# EasyEDA Pro project 工程技术综合实践课程设计.eprj, board 核心板PCB
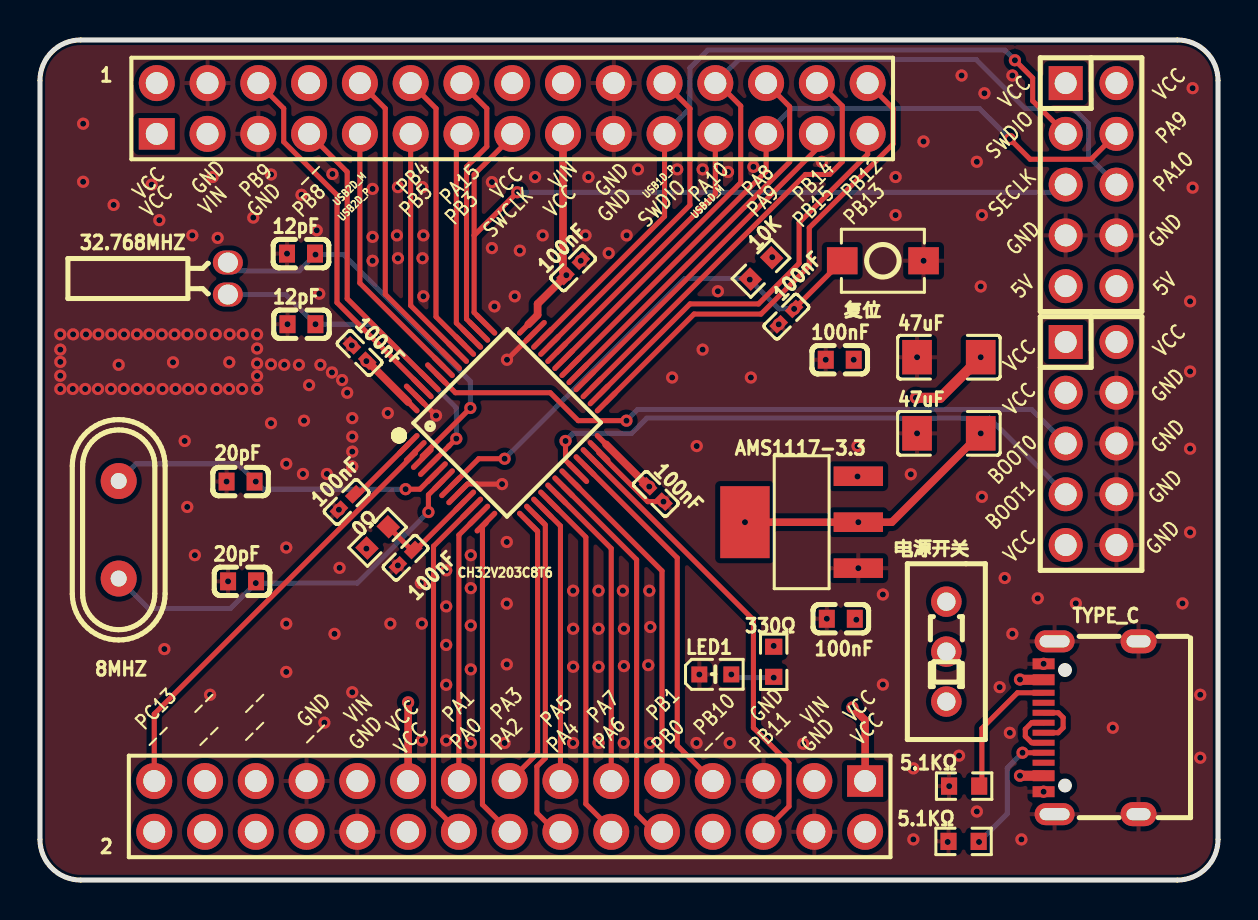
[diagram p4: board, top side]
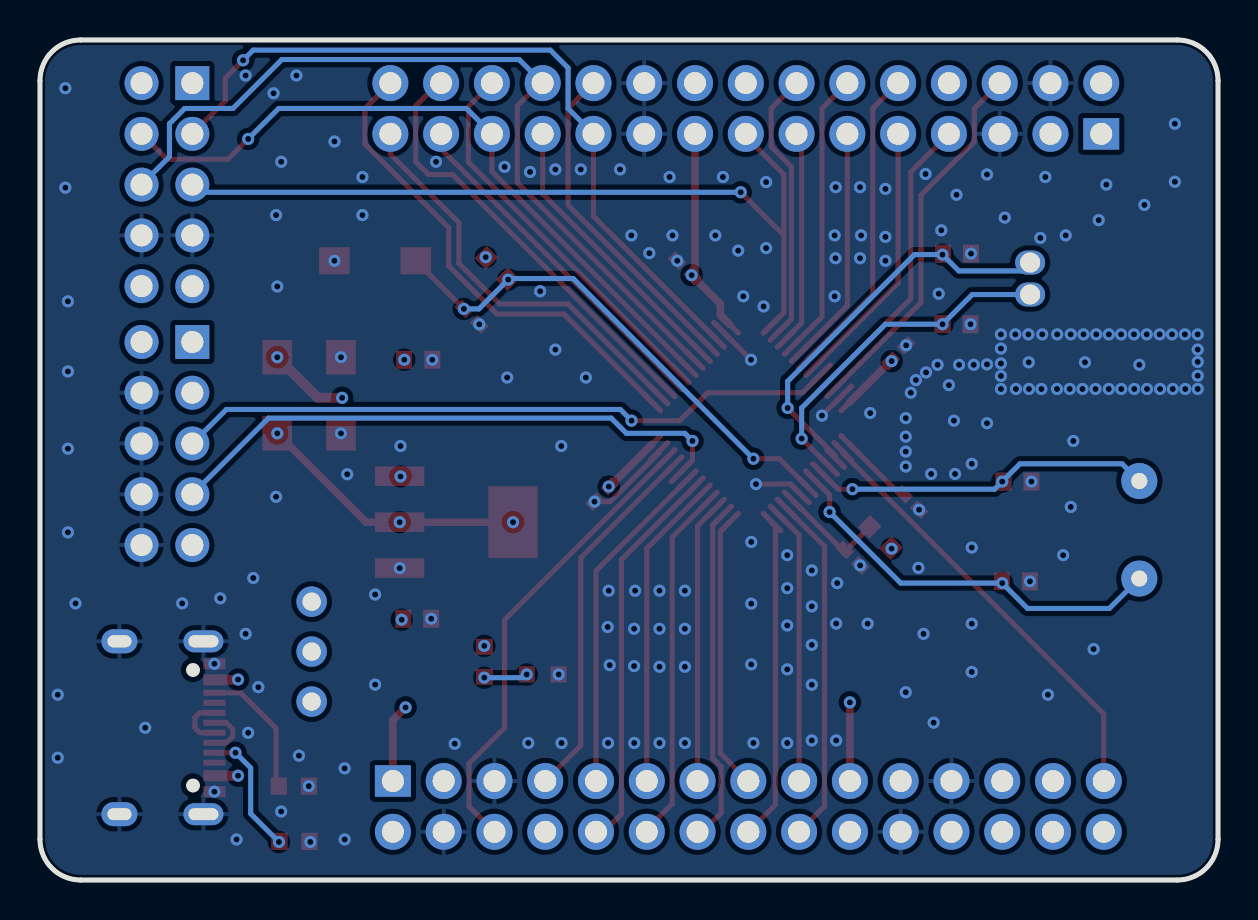
[diagram p5: board, bottom side, seen from below]

Outline 58.93 x 42.04 mm; copper layers: Top Layer, 电源层, GND层, Bottom Layer. Coordinates in mm from the lower left corner of the outline.
Outline path: 0,40 0,2.03 arc(0.6,0.6) 2.03,0 56.9,0 arc(58.33,0.6) 58.93,2.03 58.93,40 arc(58.33,41.44) 56.9,42.04 2.03,42.04 arc(0.6,41.44) 0,40
Stack: Top Layer 0.035mm 外层铜厚1oz / Dielectric1 0.2104mm 7628 RC49% 8.6mil / 电源层 0.0152mm 内层铜厚 / Dielectric2 1.065mm 1.1mm H/HOZ Copper / GND层 0.0152mm 内层铜厚 / Dielectric3 0.2104mm 7628 RC49% 8.6mil / Bottom Layer 0.035mm 外层铜厚1oz

## Design rules (mm)
template: 自定义配置
spacing copperThickness1oz (default): track to track 0.102, other pairs 0.152 to 0.3
spacing copperThickness2oz: track to track 0.203, other pairs 0.152 to 0.3
track width copperThickness1oz (default): min 0.127, default 0.254, max 2.54
track width copperThickness2oz: min 0.203, default 0.254, max 2.54
differential pair differentialPair (default): width min 0.127, default 0.254, max 2.54; gap min 0.152, default 0.152
via viaSize (default): diameter min 0.5, default 0.61, max 10; hole min 0.3, default 0.305, max 6.3

## Placement (name value [footprint] x y rotation side)
0Ω  0Ω  [R0603]  16.89 17.14 45 top
1  COM2X15_2.54_DIP  [HDR-TH_30P-P2.54-V-M-R2-C15-S2.54]  23.62 38.61 0 top
2  COM2X15_2.54_DIP  [HDR-TH_30P-P2.54-V-M-R2-C15-S2.54]  23.5 3.68 180 top
5.1KΩ  -  [R0603]  46.2 1.93 180 top
5.1KΩ#2  -  [R0603]  46.23 4.7 180 top
8MHZ  8MHz  [HC-49US_L11.0-W4.6-P4.88]  3.94 17.53 90 top
10K  10K  [R0603]  36.07 30.61 225 top
12pF  -  [C0603]  13.06 31.35 0 top
12pF#2  -  [C0603]  13.08 27.81 0 top
20pF  -  [C0603]  10.03 19.94 0 top
20pF#2  -  [C0603]  10.11 14.95 0 top
32.768MHZ  32.768kHz  [OSC-TH_BD2.0-P0.50]  9.4 30.1 90 top
47uF  -  [C1206]  45.47 22.35 0 top
47uF#2  -  [C1206]  45.47 26.16 0 top
100nF  -  [C0402]  18.29 16.13 45 top
100nF#2  -  [C0402]  30.8 19.32 315 top
100nF#3  -  [C0402]  15.99 26.37 315 top
100nF#4  -  [C0402]  26.67 30.61 45 top
100nF#5  -  [C0402]  37.34 28.19 225 top
100nF#6  -  [C0402]  15.34 18.92 45 top
100nF#7  -  [C0603]  40.06 13.07 0 top
100nF#8  -  [C0603]  40 26.03 0 top
330Ω  330Ω  [R0603]  36.7 10.92 270 top
AMS1117-3.3  AMS1117-3.3  [SOT-223-4_L6.5-W3.5-P2.30-LS7.0-BR]  38.1 17.91 0 top
CH32V203C8T6  CH32V203C8T6  [LQFP-48_L7.0-W7.0-P0.50-LS9.0-BL]  23.37 22.86 315 top
LED1  KT-0603W  [LED0603-R-RD_WHITE]  33.78 10.29 0 top
TYPE_C  TYPE-C 16PIN 2MD(073)  [USB-C-SMD_TYPE-C-6PIN-2MD-073]  52.58 7.62 90 top
U3  双排针蓝A_HEADER5X2  [HDR-TH_10P-P2.54-V-M-R2-C5-S2.54]  52.58 34.8 270 top
U4  双排针蓝A_HEADER5X2  [HDR-TH_10P-P2.54-V-M-R2-C5-S2.54]  52.58 21.84 270 top
复位  KEY-3*4*2  [SW-SMD_L4.0-W2.9-LS5.0]  42.16 30.99 0 top
电源开关  开关  [SW-TH_SS-12D01-GX]  45.34 11.43 90 top

## Footprints (pads in the part's own frame, mm; a bottom-side part is the same pattern mirrored in y, then rotated)
C0402
  rect 0.79x0.54 smd: 1(-0.545,0) 2(0.545,0)
C0603
  rect 0.8x0.9 smd: 1(-0.7,0) 2(0.7,0)
C1206
  rect 1.485x1.728 smd: 1(-1.593,0) 2(1.593,0)
HC-49US_L11.0-W4.6-P4.88
  round 1.8 hole 0.8: 1(-2.44,0) 2(2.44,0)
HDR-TH_10P-P2.54-V-M-R2-C5-S2.54
  rect 1.7x1.7 hole 1.1: 1(-5.08,-1.27)
  round 1.7 hole 1.1: 2(-5.08,1.27) 3(-2.54,-1.27) 4(-2.54,1.27) 5(0,-1.27) 6(0,1.27) 7(2.54,-1.27) 8(2.54,1.27) 9(5.08,-1.27) 10(5.08,1.27)
HDR-TH_30P-P2.54-V-M-R2-C15-S2.54
  rect 1.8x1.575 hole 1.1: 1(-17.78,-1.27)
  round 1.8 hole 1.1: 2(-17.78,1.27) 3(-15.24,-1.27) 4(-15.24,1.27) 5(-12.7,-1.27) 6(-12.7,1.27) 7(-10.16,-1.27) 8(-10.16,1.27) 9(-7.62,-1.27) 10(-7.62,1.27) 11(-5.08,-1.27) 12(-5.08,1.27) 13(-2.54,-1.27) 14(-2.54,1.27) 15(0,-1.27) 16(0,1.27) 17(2.54,-1.27) 18(2.54,1.27) 19(5.08,-1.27) 20(5.08,1.27) 21(7.62,-1.27) 22(7.62,1.27) 23(10.16,-1.27) 24(10.16,1.27) 25(12.7,-1.27) 26(12.7,1.27) 27(15.24,-1.27) 28(15.24,1.27) 29(17.78,-1.27) 30(17.78,1.27)
LED0603-R-RD_WHITE
  rect 0.8x0.8 smd: 1(0.8,0) 2(-0.8,0)
LQFP-48_L7.0-W7.0-P0.50-LS9.0-BL
  oval 0.27x1.5 smd: 1(-2.75,-4.25) 2(-2.25,-4.25) 3(-1.75,-4.25) 4(-1.25,-4.25) 5(-0.75,-4.25) 6(-0.25,-4.25) 7(0.25,-4.25) 8(0.75,-4.25) 9(1.25,-4.25) 10(1.75,-4.25) 11(2.25,-4.25) 12(2.75,-4.25) 25(2.75,4.25) 26(2.25,4.25) 27(1.75,4.25) 28(1.25,4.25) 29(0.75,4.25) 30(0.25,4.25) 31(-0.25,4.25) 32(-0.75,4.25) 33(-1.25,4.25) 34(-1.75,4.25) 35(-2.25,4.25) 36(-2.75,4.25)
  oval 1.5x0.27 smd: 13(4.25,-2.75) 14(4.25,-2.25) 15(4.25,-1.75) 16(4.25,-1.25) 17(4.25,-0.75) 18(4.25,-0.25) 19(4.25,0.25) 20(4.25,0.75) 21(4.25,1.25) 22(4.25,1.75) 23(4.25,2.25) 24(4.25,2.75) 37(-4.25,2.75) 38(-4.25,2.25) 39(-4.25,1.75) 40(-4.25,1.25) 41(-4.25,0.75) 42(-4.25,0.25) 43(-4.25,-0.25) 44(-4.25,-0.75) 45(-4.25,-1.25) 46(-4.25,-1.75) 47(-4.25,-2.25) 48(-4.25,-2.75)
OSC-TH_BD2.0-P0.50
  oval 1.2x1.5 hole 1: 1(-0.8,0) 2(0.8,0)
R0603
  rect 0.806x0.864 smd: 1(-0.753,0) 2(0.753,0)
SOT-223-4_L6.5-W3.5-P2.30-LS7.0-BR
  rect 2.47x0.98 smd: 1(2.835,-2.3) 2(2.835,0) 3(2.835,2.3)
  rect 2.47x3.6 smd: 4(-2.835,0)
SW-SMD_L4.0-W2.9-LS5.0
  rect 1.53x1.36 smd: 1(-2.035,0) 2(2.035,0)
SW-TH_SS-12D01-GX
  round 1.524 hole 0.914: 1(-2.5,0) 2(0,0) 3(2.5,0)
USB-C-SMD_TYPE-C-6PIN-2MD-073
  rect 0.55x1.1 smd: 1(-3.2,2.375) 2(-2.4,2.375) 11(2.4,2.375) 12(3.2,2.375)
  rect 0.3x1.1 smd: 3(-1.75,2.375) 4(-1.25,2.375) 5(-0.75,2.375) 6(-0.25,2.375) 7(0.25,2.375) 8(0.75,2.375) 9(1.25,2.375) 10(1.75,2.375)
  oval 1.1x2 hole 0.6x1.5: 13(-4.325,1.825) 14(4.325,1.825)
  oval 1.2x1.8 hole 0.6x1.2: 13(-4.325,-2.375) 14(4.325,-2.375)

## Nets
5V: 47uF#2.2 100nF#7.2 AMS1117-3.3.3 U3.9 U3.10 电源开关.2
GND: 1.4 1.5 1.19 1.20 2.4 2.5 2.22 2.23 5.1KΩ.2 5.1KΩ#2.2 12pF.1 12pF#2.1 20pF.1 20pF#2.1 47uF.1 47uF#2.1 100nF.1 100nF#2.2 100nF#3.1 100nF#4.2 100nF#5.2 100nF#6.1 100nF#7.1 100nF#8.1 AMS1117-3.3.1 CH32V203C8T6.8 CH32V203C8T6.23 CH32V203C8T6.35 CH32V203C8T6.47 LED1.2 TYPE_C.1 TYPE_C.12 TYPE_C.13 TYPE_C.14 U3.7 U3.8 U4.4 U4.6 U4.8 U4.10 复位.2
VCC: 0Ω.1 1.1 1.2 1.16 1.17 2.1 2.2 2.19 2.20 10K.1 47uF.2 100nF#2.1 100nF#3.2 100nF#4.1 100nF#8.2 330Ω.1 AMS1117-3.3.2 AMS1117-3.3.4 CH32V203C8T6.24 CH32V203C8T6.36 CH32V203C8T6.48 U3.1 U3.2 U4.1 U4.2 U4.3 U4.9
VIN: 1.3 1.18 2.3 2.21 TYPE_C.2 TYPE_C.11 电源开关.3
BOOT0: CH32V203C8T6.44 U4.5
BOOT1: CH32V203C8T6.20 U4.7
NRST: 10K.2 100nF#5.1 CH32V203C8T6.7 复位.1
PA0: 2.18 CH32V203C8T6.10
PA1: 2.17 CH32V203C8T6.11
PA2: 2.16 CH32V203C8T6.12
PA3: 2.15 CH32V203C8T6.13
PA4: 2.14 CH32V203C8T6.14
PA5: 2.13 CH32V203C8T6.15
PA6: 2.12 CH32V203C8T6.16
PA7: 2.11 CH32V203C8T6.17
PA8: 1.26 CH32V203C8T6.29
PA9: 1.25 CH32V203C8T6.30 U3.4
PA10: 1.24 CH32V203C8T6.31 U3.6
PA15: 1.14 CH32V203C8T6.38
PB0: 2.10 CH32V203C8T6.18
PB1: 2.9 CH32V203C8T6.19
PB3: 1.13 CH32V203C8T6.39
PB4: 1.12 CH32V203C8T6.40
PB5: 1.11 CH32V203C8T6.41
PB8: 1.7 CH32V203C8T6.45
PB9: 1.6 CH32V203C8T6.46
PB10: 2.7 CH32V203C8T6.21
PB11: 2.6 CH32V203C8T6.22
PB12: 1.30 CH32V203C8T6.25
PB13: 1.29 CH32V203C8T6.26
PB14: 1.28 CH32V203C8T6.27
PB15: 1.27 CH32V203C8T6.28
PC13: 2.29 CH32V203C8T6.2
PC14: 12pF.2 32.768MHZ.2 CH32V203C8T6.3
PC15: 12pF#2.2 32.768MHZ.1 CH32V203C8T6.4
PD0: 8MHZ.2 20pF.2 CH32V203C8T6.5
PD1: 8MHZ.1 20pF#2.2 CH32V203C8T6.6
SWCLK: 1.15 CH32V203C8T6.37 U3.5
SWDIO: 1.21 CH32V203C8T6.34 U3.3
USB1D_M: 1.23 CH32V203C8T6.32
USB1D_P: 1.22 CH32V203C8T6.33
USB2D_M: 1.10 CH32V203C8T6.42
USB2D_P: 1.9 CH32V203C8T6.43
USB_D+: TYPE_C.6 TYPE_C.8
USB_D-: TYPE_C.5 TYPE_C.7
$1N574: 0Ω.2 100nF.2 CH32V203C8T6.9
$1N590: 100nF#6.2 CH32V203C8T6.1
$1N2019: 5.1KΩ#2.1 TYPE_C.10
$1N2020: 5.1KΩ.1 TYPE_C.4
$1N2948: 330Ω.2 LED1.1

Pads without a net: 1 8; 2 8 24 25 26 27 28 30; TYPE_C 3 9; 电源开关 1

## Via types
v1: diameter 0.61, hole 0.305, Top Layer to Bottom Layer, 251 vias

## Routing (per net, layer and track width the routed paths; a pad name or vN(x,y) marks a point on that pad's centre or on a via; arc(x,y) is an arc through that point)
5V: length 31.4
  Top Layer w0.508: v1(47.06,26.16) 45.03,24.13 v1(43.81,24.13)
  电源层 w0.508: 53.85,29.72 50.61,29.72 v1(47.06,26.16) ; 43.56,13.06 43.56,18.54 41.91,20.19 ; 43.56,13.06 45.19,11.43 电源开关.2 ; 43.56,13.06 40.87,13.06 v1(40.84,13.03) ; 41.91,20.19 41.91,22.73 43.31,24.13 v1(43.81,24.13) ; 41.91,20.19 v1(40.89,20.19)
GND: length 222.9
  Top Layer w0.254: v1(23.11,19.81) 21.86,19.81 21.85,19.82 21.39,19.82 CH32V203C8T6.8 ; v1(19.81,23.24) 18.78,24.27 18.77,24.27 ; CH32V203C8T6.23 27.96,21.38 30.4,18.94 v1(31.19,18.94) ; 24.78,27.46 v1(23.36,26.03)
  GND层 w0.254: v1(32.98,10.29) 32.98,17.14 v1(31.19,18.94) 30.16,17.91 29.21,17.91 27.31,19.81 v1(23.11,19.81) ; v1(32.98,10.29) 36.19,7.07 2.5 2.4 40.13,1.02 44.7,1.02 45.41,1.72 v1(45.41,1.91) 45.41,4.62 v1(45.48,4.7) 48.51,4.7 48.9,4.32 50.1,4.32 v1(50.2,4.42) 50.75,3.87 TYPE_C.13 TYPE_C.13 TYPE_C.14 ; v1(32.98,10.29) 35.77,13.07 v1(39.36,13.07) 40.94,14.65 v1(40.94,15.61) ; v1(43.87,22.35) 43.87,22.92 44.45,23.49 44.45,25.78 44.07,26.16 v1(43.87,26.16) ; v1(50.2,10.82) 50.75,11.37 TYPE_C.14 TYPE_C.14 ; TYPE_C.14 54.95,15.66 U4.10 U4.6 U4.4 55.37,25.91 55.37,30.73 U3.8 U3.7 45.47,32.26 v1(44.2,30.99) 44.2,26.49 v1(43.87,26.16) ; 9.41,16.14 11.8,18.53 v1(14.95,18.53) 15.88,18.53 17.9,16.5 v1(17.9,15.74) 19.05,15.74 v1(23.11,19.81) ; 9.41,16.14 9.41,19.86 v1(9.33,19.94) ; 9.41,16.14 v1(9.41,14.95) 9.41,8.88 2.23 2.22 ; v1(19.81,23.24) 20.57,23.24 21.97,21.84 21.97,20.95 v1(23.11,19.81) ; v1(19.81,23.24) 22.61,26.03 v1(23.36,26.03) 27.05,29.72 v1(27.05,30.99) 28.7,32.64 28.7,39.88 ; v1(19.81,23.24) 17.27,25.78 17.27,26.54 17.09,26.72 15.64,26.72 v1(15.6,26.76) 13.44,26.76 v1(12.38,27.81) 12.38,31.32 v1(12.36,31.35) 12.36,35.9 1.5 8.38,39.88 ; v1(43.87,26.16) 42.73,25.02 40.32,25.02 v1(39.31,26.03) 37.53,27.81 v1(36.95,27.81)
  vias: v1(1.02,27.3) v1(1.02,26.54) v1(1.02,25.93) v1(1.02,25.23) v1(1.02,24.57) v1(1.64,24.57) v1(1.66,27.3) v1(2.16,37.85) v1(2.16,34.94) v1(2.3,27.3) v1(2.26,24.57) v1(2.92,27.3) v1(2.9,24.57) v1(3.57,27.3) v1(3.55,24.57) v1(3.68,33.78) v1(3.94,25.78) v1(4.2,27.3) v1(4.19,24.57) v1(4.84,24.57) v1(4.85,27.3) v1(5.46,27.3) v1(5.46,24.57) v1(5.59,34.8) v1(5.97,33.02) v1(6.09,27.3) v1(6.13,24.57) v1(6.22,11.56) v1(6.73,27.3) v1(6.66,25.91) v1(6.78,24.57) v1(7.24,21.97) v1(7.37,27.3) v1(7.42,24.57) v1(7.37,18.67) v1(7.62,32.26) v1(7.75,16.26) v1(8.05,27.3) v1(8.06,24.57) v1(8.51,9.27) v1(8.64,35.18) v1(8.79,27.3) v1(8.83,24.57) v1(8.89,32.13) v1(9.49,27.3) v1(9.47,25.91) v1(9.46,24.57) v1(10.14,27.3) v1(10.11,24.57) v1(10.67,33.15) v1(10.86,27.3) v1(10.86,26.6) v1(10.86,25.85) v1(10.86,25.22) v1(10.86,24.57) v1(11.56,35.31) v1(11.56,25.8) v1(11.56,22.86) v1(12.22,25.78) v1(12.32,20.83) v1(12.32,16.64) v1(12.32,12.83) v1(12.32,10.41) v1(12.95,25.78) v1(13.08,34.29) v1(13.21,22.99) v1(13.15,20.32) v1(13.46,24.77) v1(13.84,32.51) v1(13.97,29.34) v1(14.03,25.78) v1(14.22,7.87) v1(14.35,20.32) v1(14.63,35.33) v1(14.61,25.4) v1(14.73,12.32) v1(14.99,15.62) v1(15.11,25.02) v1(15.37,24.38) v1(15.62,23.11) v1(15.62,22.19) v1(15.62,21.44) v1(15.62,20.69) v1(15.62,9.4) v1(16.64,34.58) v1(16.64,32.18) v1(16.64,30.99) v1(17.4,23.37) v1(17.53,12.83) v1(17.91,34.67) v1(17.86,32.26) v1(17.91,31.11) v1(19.13,34.67) v1(19.13,31.11) v1(19.05,14.86) v1(19.1,12.83) v1(19.1,6.98) v1(19.18,32.26) v1(19.18,29.21) v1(20.32,15.49) v1(20.32,13.69) v1(20.32,11.77) v1(20.32,9.77) v1(20.32,6.98) v1(21.55,16.26) v1(21.55,14.6) v1(21.55,12.74) v1(21.55,10.54) v1(21.55,6.86) v1(22.61,34.92) v1(22.61,31.62) v1(22.73,28.7) v1(23.24,6.86) v1(23.35,16.92) v1(23.35,13.83) v1(23.35,10.79) v1(23.75,29.21) v1(24,31.5) v1(24.77,35.18) v1(25.15,32.26) v1(26.67,14.48) v1(26.67,12.57) v1(26.67,10.67) v1(26.67,6.86) v1(27.29,32.26) v1(27.43,35.18) v1(27.94,14.48) v1(27.94,12.57) v1(27.94,10.67) v1(27.94,6.86) v1(28.45,31.37) v1(29.16,14.48) v1(29.21,12.57) v1(29.21,10.71) v1(29.2,6.86) v1(29.35,32.26) v1(29.91,35.56) v1(30.43,10.75) v1(30.48,14.48) v1(30.53,12.66) v1(30.51,6.86) v1(31.62,25.15) v1(31.88,35.56) v1(32.84,6.86) v1(32.85,21.72) v1(33.15,35.56) v1(33.15,26.54) v1(33.91,29.46) v1(34.42,35.43) v1(34.5,6.86) v1(35.56,25.15) v1(35.69,35.69) v1(38.18,6.82) v1(39.12,35.94) v1(40.89,21.72) v1(42.16,14.29) v1(42.16,9.78) v1(42.8,35.18) v1(42.8,33.27) v1(43.56,20.3) v1(43.69,5.59) v1(43.69,2.03) v1(44.2,36.96) v1(45.97,6.22) v1(46.1,40.26) v1(46.86,35.94) v1(46.86,3.43) v1(47.12,33.27) v1(47.06,29.7) v1(47.12,19.18) v1(47.24,39.37) v1(48.01,9.65) v1(48.26,15.11) v1(48.51,7.37) v1(48.64,40.26) v1(48.64,12.32) v1(49.09,2.03) v1(49.91,14.1) v1(51.82,13.84) v1(53.67,7.62) v1(57.15,13.84) v1(57.53,28.96) v1(57.53,25.45) v1(57.53,21.58) v1(57.53,17.4) v1(57.66,39.62) v1(57.66,34.65) v1(58.04,9.27) v1(58.04,6.12)
VCC: length 175.3
  Top Layer w0.381: 2.1 41.28,8 v1(40.64,8.64) ; CH32V203C8T6.36 24.89,28.27 24.89,28.83 v1(26.33,30.27) 26.16,30.44 1.17 ; v1(47.06,22.35) 42.61,17.91 v1(40.94,17.91) v1(35.27,17.91) ; CH32V203C8T6.24 30.43,19.69 v1(30.48,19.69) ; 100nF#3.2 16.37,25.97 CH32V203C8T6.48 ; 2.19 v1(18.42,8.89)
  电源层 w0.254: v1(26.33,30.27) 29.12,30.27 30.03,31.17 v1(36.63,31.17)
  电源层 w0.381: v1(18.42,8.89) 18.42,13.97 16.33,16.06 v1(16.33,16.58) 16.33,16.59 v1(16.33,25.97) 16.33,28.14 18.46,30.27 ; 48.61,23.37 48.07,23.37 v1(47.06,22.35) ; 48.61,23.37 50.29,23.37 U4.3 U4.1 U4.2 55.25,28.32 55.25,38.48 U3.2 U3.1 ; 48.61,23.37 49.91,22.07 49.91,18.16 U4.9 ; v1(30.48,19.69) 33.48,19.69 v1(35.27,17.91) 36.7,16.47 v1(36.7,11.72) 39.78,8.64 v1(40.64,8.64) ; 18.46,30.27 v1(26.33,30.27) ; 18.46,30.27 11.9,30.27 5.84,36.32 1.1 1.2 ; 1.16 1.17 ; 2.20 2.19 ; 2.1 2.2 ; v1(36.63,31.17) 37.67,31.17 40.71,28.13 v1(40.71,26.03) 39.88,25.21 39.88,18.96 v1(40.94,17.91)
VIN: length 139.2
  Top Layer w0.508: TYPE_C.11 49.03,10.02 v1(49.02,10.03) ; 50.2,5.22 v1(49.02,5.22)
  电源层 w0.508: 41.53,7.75 2.3 ; 41.53,7.75 45.93,7.75 47.12,8.93 ; 41.53,7.75 18.67,7.75 2.21 ; 45.47,27.81 45.47,14.06 电源开关.3 45.63,13.93 47.12,12.45 47.12,11.94 ; 45.47,27.81 45.47,38.73 42.8,41.4 27.69,41.4 1.18 ; 45.47,27.81 40,33.27 12.45,33.27 8.38,37.34 ; 47.12,8.93 47.12,7.12 v1(49.02,5.22) ; 47.12,8.93 47.12,11.94 ; 47.12,11.94 v1(49.02,10.03)
BOOT0: length 33.4
  Top Layer w0.254: v1(29.34,22.99) 26.92,22.99 25.53,24.38 20.78,24.38 CH32V203C8T6.44
  Bottom Layer w0.254: U4.5 49.61,23.55 29.9,23.55 v1(29.34,22.99)
BOOT1: length 28.9
  Top Layer w0.254: CH32V203C8T6.20 26.29,21 v1(26.29,21.97)
  Bottom Layer w0.254: v1(26.29,21.97) 26.67,22.35 29.59,22.35 30.35,23.11 47.5,23.11 51.31,19.3
NRST: length 25.5
  Top Layer w0.254: v1(23.24,21.08) 21.94,21.08 20.54,19.68 ; v1(37.72,28.58) 40.13,30.98 复位.1
  Bottom Layer w0.254: v1(23.24,21.08) 32.26,30.1 35.45,30.1 v1(35.51,30.05) 36.97,28.58 v1(37.72,28.58)
PA0: length 17.5
  Top Layer w0.254: 2.18 19.69,3.68 19.69,16.7 CH32V203C8T6.10
PA1: length 13.7
  Top Layer w0.254: 2.17 20.96,17.27 21.95,18.26
PA2: length 16.1
  Top Layer w0.254: 2.16 22.13,3.77 22.13,17.69 22.31,17.86 CH32V203C8T6.12
PA3: length 13.7
  Top Layer w0.254: CH32V203C8T6.13 24.89,17.45 24.89,6.35 2.15
PA4: length 16.9
  Top Layer w0.254: 2.14 25.8,2.41 24.86,3.35 24.86,5.68 25.28,6.1 25.28,17.77 24.78,18.26
PA5: length 14
  Top Layer w0.254: 2.13 26.03,17.72 CH32V203C8T6.15
PA6: length 17.8
  Top Layer w0.254: 2.12 28.58,2.54 27.31,3.81 27.31,17.16 CH32V203C8T6.16
PA7: length 15.5
  Top Layer w0.254: 2.11 28.58,16.59 CH32V203C8T6.17
PA8: length 19.4
  Top Layer w0.254: CH32V203C8T6.29 37.5,35.93 37.5,38.7 1.26
PA9: length 35.3
  Top Layer w0.254: CH32V203C8T6.30 36.32,35.46 1.25 ; 53.85,37.34 52.58,36.07 49.53,36.07 v1(48.51,37.08)
  Bottom Layer w0.254: v1(48.51,37.08) 46.99,38.61 37.59,38.61 1.25
PA10: length 42.2
  Top Layer w0.254: CH32V203C8T6.31 35.05,34.9 35.05,38.73 33.91,39.88 1.24
  Bottom Layer w0.254: 1.24 34.96,41.06 46.83,41.06 49.28,38.61 51.69,38.61 52.45,37.85 52.45,36.19 U3.6
PA15: length 13.6
  Top Layer w0.254: CH32V203C8T6.38 21.34,28.07 21.34,35.69 22.35,36.7 22.35,38.61 21.08,39.88
PB0: length 19.5
  Top Layer w0.254: 2.10 30.73,2.41 29.84,3.3 29.84,16.03 26.2,19.68
PB1: length 17
  Top Layer w0.254: 2.9 31.12,15.47 CH32V203C8T6.19
PB3: length 10.7
  Top Layer w0.254: 21.08,37.34 20.83,37.08 20.83,27.88 CH32V203C8T6.39
PB4: length 14.2
  Top Layer w0.254: CH32V203C8T6.40 19.81,28.18 19.81,38.61 1.12
PB5: length 11.9
  Top Layer w0.254: 1.11 18.54,28.75 CH32V203C8T6.41
PB8: length 14.8
  Top Layer w0.254: CH32V203C8T6.45 15.37,29.09 15.37,35.43 1.7
PB9: length 18.6
  Top Layer w0.254: CH32V203C8T6.46 14.86,28.89 14.86,34.27 12.19,36.94 12.19,38.61 1.6
PB10: length 18.4
  Top Layer w0.254: 2.7 31.88,6.73 31.88,16.12 CH32V203C8T6.21
PB11: length 23.3
  Top Layer w0.254: 2.6 37.47,3.68 37.47,5.84 35.69,7.62 35.69,13.02 CH32V203C8T6.22
PB12: length 24.4
  Top Layer w0.254: 1.30 42.67,38.61 42.67,36.83 38.48,32.64 38.48,30.73 36.07,28.32 32.72,28.32 CH32V203C8T6.25
PB13: length 20.6
  Top Layer w0.254: 27.96,24.27 32.52,28.83 35.94,28.83 37.97,30.86 37.97,32.89 41.4,36.32 1.29
PB14: length 21.7
  Top Layer w0.254: CH32V203C8T6.27 38.29,35.31 39.5,35.31 40.13,35.94 40.13,38.73 38.99,39.88 38.86,39.88
PB15: length 17.2
  Top Layer w0.254: CH32V203C8T6.28 38.86,36.59 38.86,37.34
PC13: length 21.9
  Top Layer w0.254: 2.29 5.72,8.31 18.77,21.36 18.77,21.45
PC14: length 20.1
  Top Layer w0.254: CH32V203C8T6.3 19.13,21.21 21.53,23.62 v1(21.53,23.62)
  Bottom Layer w0.254: 32.768MHZ.2 9.82,30.48 12.97,30.48 v1(13.78,31.3) 15.19,31.3 21.53,24.95 v1(21.53,23.62)
PC15: length 17.2
  Top Layer w0.254: CH32V203C8T6.4 20.46,21.72 20.46,21.72 v1(20.83,22.09)
  Bottom Layer w0.254: v1(20.83,22.09) 20.83,23.62 16.64,27.81 v1(13.78,27.81) 12.3,29.3 32.768MHZ.1
PD0: length 17.1
  Top Layer w0.254: CH32V203C8T6.5 19.01,19.56 v1(18.29,19.56)
  Bottom Layer w0.254: 8MHZ.2 4.8,20.83 9.91,20.83 v1(10.8,19.94) 11.18,19.56 v1(18.29,19.56)
PD1: length 20
  Top Layer w0.254: v1(19.43,18.41) 19.43,19.28 20.19,20.03
  Bottom Layer w0.254: v1(19.43,18.41) 15.88,14.86 v1(10.8,14.86) 9.53,13.59 5.43,13.59 8MHZ.1
SWCLK: length 41.2
  Top Layer w0.254: 21.72,32.26 21.72,28.4 CH32V203C8T6.37 ; 21.72,32.26 v1(23.88,34.42) ; 21.72,32.26 21.72,35.31 23.62,37.21 1.15
  Bottom Layer w0.254: U3.5 50.93,34.42 v1(23.88,34.42)
SWDIO: length 38.2
  Top Layer w0.254: 51.31,37.34 49.66,38.99 49.66,40.13 v1(48.77,41.02) ; 1.21 31.24,33.21 CH32V203C8T6.34
  Bottom Layer w0.254: 1.21 32.51,38.61 32.51,40.64 33.4,41.53 48.26,41.53 v1(48.77,41.02)
USB1D_M: length 14.2
  Top Layer w0.254: 1.23 33.78,34.33 CH32V203C8T6.32
USB1D_P: length 16.6
  Top Layer w0.254: 1.22 32.51,38.61 32.51,33.77 CH32V203C8T6.33
USB2D_M: length 15.7
  Top Layer w0.254: 1.10 17.27,38.61 17.27,29.31 CH32V203C8T6.42
USB2D_P: length 13.4
  Top Layer w0.254: 1.9 16,29.87 20.19,25.69
USB_D+: length 2.7
  Top Layer w0.254: TYPE_C.6 50.93,7.37 51.18,7.62 51.18,8.13 50.94,8.37 TYPE_C.8
USB_D-: length 2.5
  Top Layer w0.254: TYPE_C.5 49.61,6.87 49.29,7.19 49.29,7.55 49.61,7.87 50.2,7.87 TYPE_C.7
$1N574: length 5.3
  Top Layer w0.254: CH32V203C8T6.9 18.79,16.51 100nF.2 18.59,16.51 0Ω.2
$1N590: length 3.7
  Top Layer w0.254: CH32V203C8T6.1 15.92,19.3 100nF#6.2
$1N2019: length 6.8
  Top Layer w0.254: TYPE_C.10 48.9,9.37 47.12,7.59 47.12,4.83 5.1KΩ#2.1
$1N2020: length 6.4
  Top Layer w0.254: TYPE_C.4 v1(49.15,6.37)
  Bottom Layer w0.254: v1(46.97,1.91) 48.39,3.32 48.39,5.61 v1(49.15,6.37)
$1N2948: length 2.2
  Bottom Layer w0.254: v1(36.7,10.13) 34.74,10.13 v1(34.58,10.29)

## Copper pours and planes (outline as drawn; the poured copper is in the pictures)
GND on Top Layer: 0,40.13 0.01,40.31 0.05,40.59 0.13,40.86 0.25,41.12 0.41,41.35 0.6,41.57 0.81,41.75 1.05,41.91 1.3,42.03 1.57,42.11 1.85,42.16 2.03,42.16 57.02,42.16 57.2,42.16 57.48,42.11 57.75,42.03 58.01,41.91 58.25,41.75 58.46,41.57 58.65,41.35 58.8,41.12 58.92,40.86 59,40.59 59.05,40.31 59.06,40.13 59.06,2.03 59.05,1.85 59,1.57 58.92,1.3 58.8,1.05 58.65,0.81 58.46,0.6 58.25,0.41 58.01,0.25 57.75,0.13 57.48,0.05 57.2,0.01 57.02,0 2.03,0 1.85,0.01 1.57,0.05 1.3,0.13 1.05,0.25 0.81,0.41 0.6,0.6 0.41,0.81 0.25,1.05 0.13,1.3 0.05,1.57 0.01,1.85 0,2.03
GND on Bottom Layer: 0,40 0.01,40.18 0.05,40.46 0.13,40.73 0.25,40.99 0.41,41.23 0.6,41.44 0.81,41.63 1.05,41.78 1.3,41.9 1.57,41.98 1.85,42.03 2.03,42.04 57.02,42.04 57.2,42.03 57.48,41.98 57.75,41.9 58.01,41.78 58.25,41.63 58.46,41.44 58.65,41.23 58.8,40.99 58.92,40.73 59,40.46 59.05,40.18 59.06,40 59.06,2.03 59.05,1.85 59,1.57 58.92,1.3 58.8,1.05 58.65,0.81 58.46,0.6 58.25,0.41 58.01,0.25 57.75,0.13 57.48,0.05 57.2,0.01 57.02,0 2.03,0 1.85,0.01 1.57,0.05 1.3,0.13 1.05,0.25 0.81,0.41 0.6,0.6 0.41,0.81 0.25,1.05 0.13,1.3 0.05,1.57 0.01,1.85 0,2.03
GND on 电源层: 0,40 0.01,40.18 0.05,40.46 0.13,40.73 0.25,40.99 0.41,41.23 0.6,41.44 0.81,41.63 1.05,41.78 1.3,41.9 1.57,41.98 1.85,42.03 2.03,42.04 57.02,42.04 57.2,42.03 57.48,41.98 57.75,41.9 58.01,41.78 58.25,41.63 58.46,41.44 58.65,41.23 58.8,40.99 58.92,40.73 59,40.46 59.05,40.18 59.06,40 59.06,2.03 59.05,1.85 59,1.57 58.92,1.3 58.8,1.05 58.65,0.81 58.46,0.6 58.25,0.41 58.01,0.25 57.75,0.13 57.48,0.05 57.2,0.01 57.02,0 2.03,0 1.85,0.01 1.57,0.05 1.3,0.13 1.05,0.25 0.81,0.41 0.6,0.6 0.41,0.81 0.25,1.05 0.13,1.3 0.05,1.57 0.01,1.85 0,2.03
GND on GND层: 0,40 0.01,40.18 0.05,40.46 0.13,40.73 0.25,40.99 0.41,41.23 0.6,41.44 0.81,41.63 1.05,41.78 1.3,41.9 1.57,41.98 1.85,42.03 2.03,42.04 57.02,42.04 57.2,42.03 57.48,41.98 57.75,41.9 58.01,41.78 58.25,41.63 58.46,41.44 58.65,41.23 58.8,40.99 58.92,40.73 59,40.46 59.05,40.18 59.06,40 59.06,2.03 59.05,1.85 59,1.57 58.92,1.3 58.8,1.05 58.65,0.81 58.46,0.6 58.25,0.41 58.01,0.25 57.75,0.13 57.48,0.05 57.2,0.01 57.02,0 2.03,0 1.85,0.01 1.57,0.05 1.3,0.13 1.05,0.25 0.81,0.41 0.6,0.6 0.41,0.81 0.25,1.05 0.13,1.3 0.05,1.57 0.01,1.85 0,2.03

## Text on the board
Top Silkscreen Layer: USB2D_M | USB2D_P | USB1D_P | USB1D_M | VCC | PC13 | -- | GND | VIN | PB9 | PB8 | PB4 | PB5 | PA15 | PA1 | PB3 | PA0 | SWCLK | PA3 | PA2 | PA5 | PA4 | PA7 | PA6 | SWDIO | PB1 | PB0 | PA10 | PB10 | PA8 | PA9 | PB11 | PB14 | PB15 | PB12 | PB13 | BOOT1 | BOOT0 | SECLK | 5V
